# EAGLE design SkyFanController (EAGLE 9.7.0)
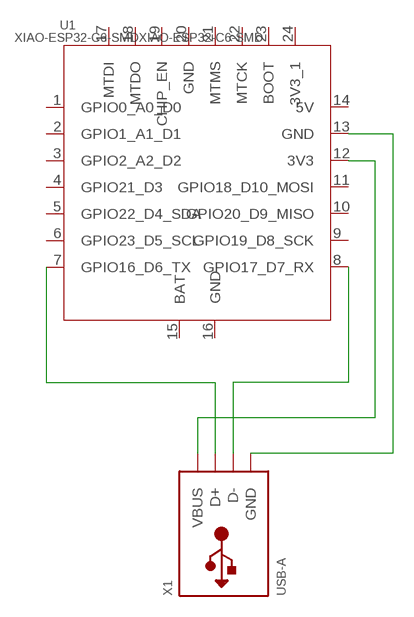
[diagram p0: schematic, sheet 1]

## Parts
U1  XIAO-ESP32-C6-SMDXIAO-ESP32-C6-SMD  [XIAO-ESP32-C6-SMD]
X1  USB-A  [MOLEX_480371000]

## Nets
3.3V: U1.12(3V3) X1.1(VBUS)
GND: U1.13(GND) X1.4(GND)
RX: U1.8(GPIO17_D7_RX) X1.2(D-)
TX: U1.7(GPIO16_D6_TX) X1.3(D+)
Unconnected: U1.1(GPIO0_A0_D0) U1.2(GPIO1_A1_D1) U1.3(GPIO2_A2_D2) U1.4(GPIO21_D3) U1.5(GPIO22_D4_SDA) U1.6(GPIO23_D5_SCL) U1.9(GPIO19_D8_SCK) U1.10(GPIO20_D9_MISO) U1.11(GPIO18_D10_MOSI) U1.14(5V) U1.15(BAT) U1.16(GND) U1.17(MTDI) U1.18(MTDO) U1.19(CHIP_EN) U1.20(GND) U1.21(MTMS) U1.22(MTCK) U1.23(BOOT) U1.24(3V3_1)

## Library data of the parts
U1 = Seeed_Studio_XIAO_Series:XIAO-ESP32-C6-SMD
X1 = adafruit:USB-A: USB type A 'plug' Used for things that can directly connect to a USB port, say USB key

## Board
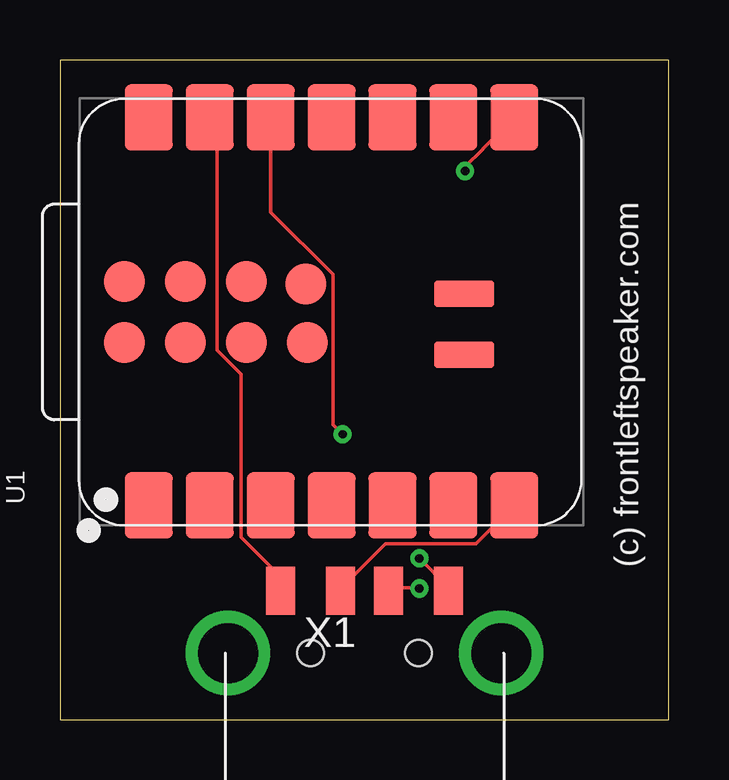
[diagram p1: board, top side]
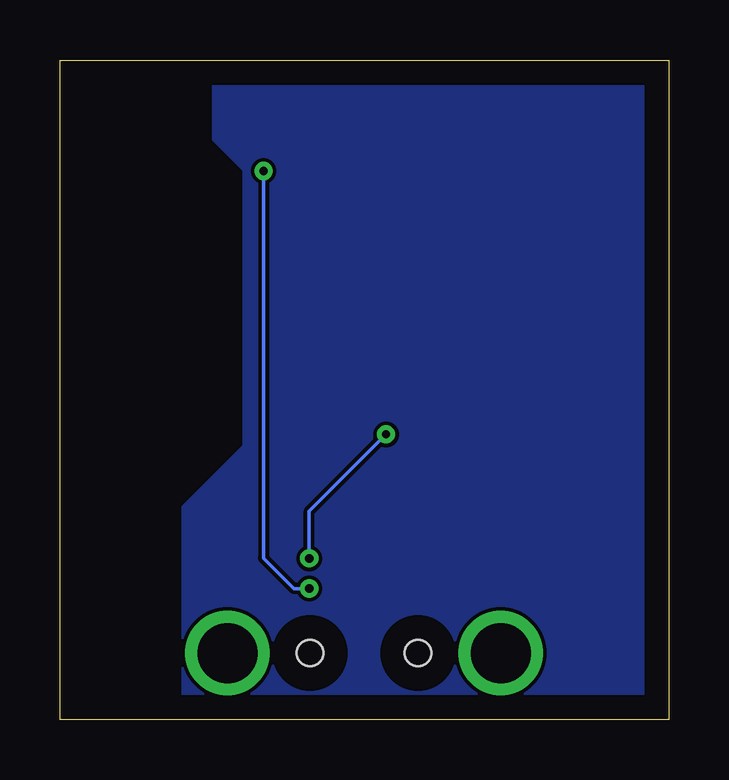
[diagram p2: board, bottom side, seen from below]

Size 25.38 x 27.48 mm. Coordinates in mm from the lower left corner, seen from the top.
Outline: 0,0 25.38,0 25.38,27.48 0,27.48 0,0
Copper layers (1*16): Top 0.035mm / dielectric 1.5mm / Bottom 0.035mm
Design rules "Fusion Electronics Design Rules": minimum track width 6mil, minimum drill 0.35mm, track to track 6mil, track to pad 6mil, pad to pad 6mil, via to via 6mil, smd to smd 6mil, copper to edge 40mil, drill to drill 6mil, minimum pad ring 10mil, minimum via ring 8mil, stop-mask expansion 4mil, vias tented up to drill 9999mil, thermal gap 10mil

### Footprints (pad centres in the part's own frame; a part is rotated, then mirrored left to right if it is on the bottom)
XIAO-ESP32-C6-SMD = smd 2.75 x 2: 1 1.878,-5.101; 2 1.878,-7.641; 3 1.878,-10.181; 4 1.878,-12.722; 5 1.878,-15.261; 6 1.878,-17.802; 7 1.878,-20.341; 8 18.043,-20.341; 9 18.043,-17.802; 10 18.043,-15.261; 11 18.043,-12.722; 12 18.043,-10.181; 13 18.043,-7.641; 14 18.043,-5.101 | smd 1.1 x 2.5: 15 8.152,-18.253; 16 10.692,-18.253 | smd 1.7 x 1.7: 17 8.66,-4.08; 18 11.2,-4.08; 19 8.66,-6.62; 20 11.2,-6.62; 21 8.66,-9.16; 22 11.2,-9.16; 23 8.66,-11.7; 24 11.107,-11.643
MOLEX_480371000 = smd 1.2 x 2: 1 3.5,2.6; 2 1,2.6; 3 -1,2.6; 4 -3.5,2.6 | drill 2.5: M1 -5.7,0; M2 5.7,0 | hole 1.1: -2.25,0; 2.25,0

### Placement (x,y rotation side)
U1  -1.4,7.05 90 top
X1  12.7,2.77 0 top

### Tracks (layer width: path | path; a pad name or v marks a point on that pad's centre or on a via)
3.3V  (via drill 0.35)
  Top 0.152: X1.1 16.2,5.5 v14.99,6.72 | U1.12 8.78,21.14 11.38,18.55 11.38,12.29 v11.79,11.89
  Bottom 0.152: v11.79,11.89 14.99,8.69 v14.99,6.72
GND
  Top 0.152: X1.4 9.14,5.49 9.14,6.02 7.56,7.6 7.56,14.39 6.55,15.39 6.55,24.78 U1.13
  pour Bottom: 17.72,11.39 17.7,11.41 17.7,22.88 17.72,22.9 18.97,24.16 18.97,27.86 0.08,27.86 0.08,0.08 20.24,0.08 20.24,8.86
RX  (via drill 0.35)
  Top 0.152: X1.2 13.72,5.49 14.96,5.49 v14.99,5.46 | v16.89,22.86 16.89,23.03 17.63,23.77 17.63,23.78 U1.8
  Bottom 0.152: v14.99,5.46 15.62,5.46 16.89,6.73 v16.89,22.86
TX
  Top 0.152: X1.3 11.73,5.49 13.57,7.32 17.35,7.32 18.95,8.91 U1.7

### Text on the board
tPlace: (c) frontleftspeaker.com